# EAGLE schematic item_2022_Frontend_01 (EAGLE 9.6.2)
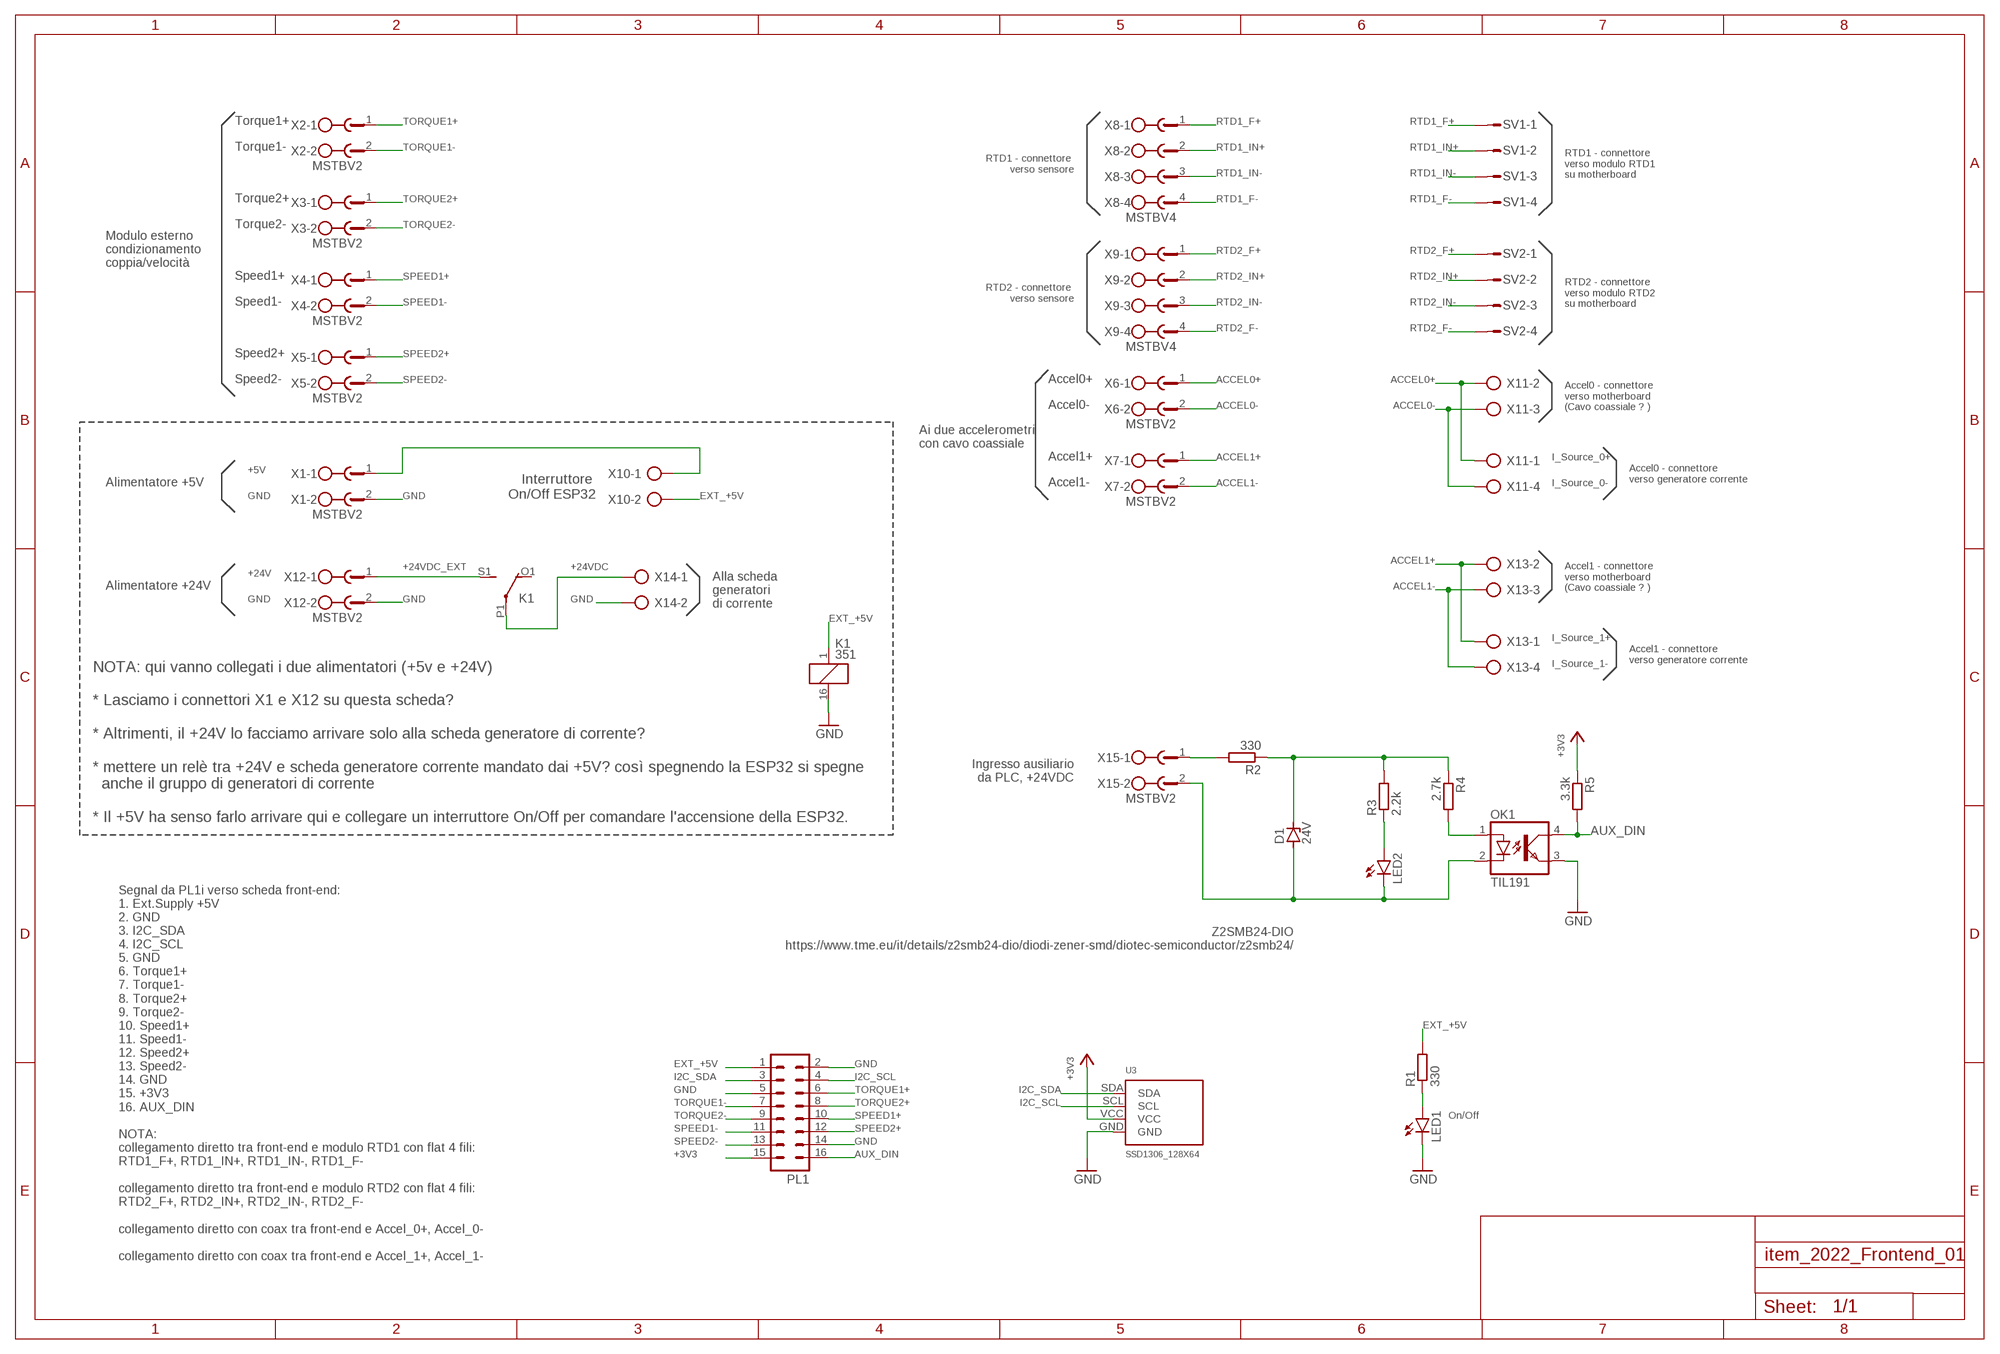
[diagram p0: schematic, sheet 1]

## Parts
D1  24V  ZENER-DIODESMB  [SMB]
K1  351  [351]
LED1  LED5MM  [LED5MM]
LED2  LED5MM  [LED5MM]
OK1  TIL191  [DIL04]
PL1  16V  [16V]
R1  330  R-EU_R0805  [R0805]
R2  330  R-EU_R0805  [R0805]
R3  2.2k  R-EU_R0805  [R0805]
R4  2.7k  R-EU_R0805  [R0805]
R5  3.3k  R-EU_R0805  [R0805]
SV1  S04P  [S04P]
SV2  S04P  [S04P]
U3  SSD1306_128X64  [128X64]
X1  MSTBV2  [MSTBV2]
X2  MSTBV2  [MSTBV2]
X3  MSTBV2  [MSTBV2]
X4  MSTBV2  [MSTBV2]
X5  MSTBV2  [MSTBV2]
X6  MSTBV2  [MSTBV2]
X7  MSTBV2  [MSTBV2]
X8  MSTBV4  [MSTBV4]
X9  MSTBV4  [MSTBV4]
X10  AK500/2  [AK500/2]
X11  AK500/4  [AK500/4]
X12  MSTBV2  [MSTBV2]
X13  AK500/4  [AK500/4]
X14  AK500/2  [AK500/2]
X15  MSTBV2  [MSTBV2]

## Nets
+3V3: PL1.15 R5.1 U3.VCC
+24VDC: K1.P1(2:P) X14.1
+24VDC_EXT: K1.S1(2:S) X12.1
ACCEL0+: X6.1 X11.1 X11.2
ACCEL0-: X6.2 X11.3 X11.4
ACCEL1+: X7.1 X13.1 X13.2
ACCEL1-: X7.2 X13.3 X13.4
AUX_DIN: OK1.4(COL) PL1.16 R5.2
EXT_+5V: K1.1 PL1.1 R1.2 X10.2
GND: K1.16 LED1.K(C) OK1.3(EMIT) PL1.2 PL1.5 PL1.14 U3.GND X1.2 X12.2 X14.2
I2C_SCL: PL1.4 U3.SCL
I2C_SDA: PL1.3 U3.SDA
N$1: R2.2 X15.1
N$2: X1.1 X10.1
N$3: LED1.A R1.1
N$4: D1.C R2.1 R3.2 R4.1
N$5: D1.A LED2.K(C) OK1.2(C) X15.2
N$8: LED2.A R3.1
N$9: OK1.1(A) R4.2
RTD1_F+: SV1.1 X8.1
RTD1_F-: SV1.4 X8.4
RTD1_IN+: SV1.2 X8.2
RTD1_IN-: SV1.3 X8.3
RTD2_F+: SV2.1 X9.1
RTD2_F-: SV2.4 X9.4
RTD2_IN+: SV2.2 X9.2
RTD2_IN-: SV2.3 X9.3
SPEED1+: PL1.10 X4.1
SPEED1-: PL1.11 X4.2
SPEED2+: PL1.12 X5.1
SPEED2-: PL1.13 X5.2
TORQUE1+: PL1.6 X2.1
TORQUE1-: PL1.7 X2.2
TORQUE2+: PL1.8 X3.1
TORQUE2-: PL1.9 X3.2
Unconnected: K1.O1(2:O) K1.O2(3:O) K1.P2(3:P) K1.S2(3:S)

## Notes on the sheet
- Torque1+
- Torque1-
- RTD1 - connettore 
  verso sensore
- RTD1 - connettore 
  verso modulo RTD1
  su motherboard
- Torque2+
- Torque2-
- Modulo esterno
  condizionamento
  coppia/velocità
- Speed1+
- RTD2 - connettore 
  verso sensore
- RTD2 - connettore 
  verso modulo RTD2
  su motherboard
- Speed1-
- Speed2+
- Speed2- | Accel0+
- Accel0 - connettore 
  verso motherboard
  (Cavo coassiale ? )
- Accel0-
- Ai due accelerometri
  con cavo coassiale
- Accel1+ | I_Source_0+
- +5V
- Accel0 - connettore 
  verso generatore corrente
- Alimentatore +5V
- Interruttore 
  On/Off ESP32
- Accel1- | I_Source_0-
- GND
- +24V
- Accel1 - connettore 
  verso motherboard
  (Cavo coassiale ? )
- Alimentatore +24V
- Alla scheda 
  generatori
  di corrente
- GND
- I_Source_1+
- Accel1 - connettore 
  verso generatore corrente
- I_Source_1-
- Ingresso ausiliario
  da PLC, +24VDC
- NOTA: qui vanno collegati i due alimentatori (+5v e +24V)
  
  * Lasciamo i connettori X1 e X12 su questa scheda?
  
  * Altrimenti, il +24V lo facciamo arrivare solo alla scheda generatore di corrente?
  
  * mettere un relè tra +24V e scheda generatore corrente mandato dai +5V? così spegnendo la ESP32 si spegne
    anche il gruppo di generatori di corrente
  
  * Il +5V ha senso farlo arrivare qui e collegare un interruttore On/Off per comandare l'accensione della ESP32.
- Z2SMB24-DIO
  https://www.tme.eu/it/details/z2smb24-dio/diodi-zener-smd/diotec-semiconductor/z2smb24/
- On/Off
- Segnal da PL1i verso scheda front-end:
  1. Ext.Supply +5V
  2. GND
  3. I2C_SDA
  4. I2C_SCL
  5. GND
  6. Torque1+
  7. Torque1-
  8. Torque2+
  9. Torque2-
  10. Speed1+
  11. Speed1-
  12. Speed2+
  13. Speed2-
  14. GND
  15. +3V3
  16. AUX_DIN
  
  NOTA:
  collegamento diretto tra front-end e modulo RTD1 con flat 4 fili:
  RTD1_F+, RTD1_IN+, RTD1_IN-, RTD1_F-
  
  collegamento diretto tra front-end e modulo RTD2 con flat 4 fili:
  RTD2_F+, RTD2_IN+, RTD2_IN-, RTD2_F-
  
  collegamento diretto con coax tra front-end e Accel_0+, Accel_0-
  
  collegamento diretto con coax tra front-end e Accel_1+, Accel_1-

## Library data of the parts
D1 = diode:ZENER-DIODE: Z-Diode
K1 = relay:351: RELAY 2 x switch, Omron; OC_FARNELL: unknown; OC_NEWARK: unknown
LED1 LED2 = led:LED: LED OSRAM: - CHIPLED LG R971, LG N971, LY N971, LG Q971, LY Q971, LO R971, LY R971 LH N974, LH R974 LS Q976, LO Q976, LY Q976 LO Q996 - Hyper CHIPLED LW Q18S LB Q993, LB Q99A, LB R99A - SideLED LS A670, LO A670, LY A670, LG A670, LP A670 LB A673, LV A673, LT A673, LW A673 LH A674 LY A675 LS A676, LA A676, LO A676, LY A676, LW A676 LS A679, LY A679, LG A679 - Hyper Micro SIDELED® LS Y876, LA Y876, LO Y876, LY Y876 LT Y87S - SmartLED LW L88C, LW L88S LB L89C, LB L89S, LG L890 LS L89K, LO L89K, LY L89K LS L896, LA L896, LO L896, LY L896 - TOPLED LS T670, LO T670, LY T670, LG T670, LP T670 LSG T670, LSP T670, LSY T670, LOP T670, LYG T670 LG T671, LOG T671, LSG T671 LB T673, LV T673, LT T673, LW T673 LH T674 LS T676, LA T676, LO T676, LY T676, LB T676, LH T676, LSB T676, LW T676 LB T67C, LV T67C, LT T67C, LS T67K, LO T67K, LY T67K, LW E67C LS E67B, LA E67B, LO E67B, LY E67B, LB E67C, LV E67C, LT E67C LW T67C LS T679, LY T679, LG T679 LS T770, LO T770, LY T770, LG T770, LP T770 LB T773, LV T773, LT T773, LW T773 LH T774 LS E675, LA E675, LY E675, LS T675 LS T776, LA T776, LO T776, LY T776, LB T776 LHGB T686 LT T68C, LB T68C - Hyper Mini TOPLED® LB M676 - Mini TOPLED Santana® LG M470 LS M47K, LO M47K, LY M47K Source: http://www.osram.convergy.de LUXEON: - LUMILED® LXK2-PW12-R00, LXK2-PW12-S00, LXK2-PW14-U00, LXK2-PW14-V00 LXK2-PM12-R00, LXK2-PM12-S00, LXK2-PM14-U00 LXK2-PE12-Q00, LXK2-PE12-R00, LXK2-PE12-S00, LXK2-PE14-T00, LXK2-PE14-U00 LXK2-PB12-K00, LXK2-PB12-L00, LXK2-PB12-M00, LXK2-PB14-N00, LXK2-PB14-P00, LXK2-PB14-Q00 LXK2-PR12-L00, LXK2-PR12-M00, LXK2-PR14-Q00, LXK2-PR14-R00 LXK2-PD12-Q00, LXK2-PD12-R00, LXK2-PD12-S00 LXK2-PH12-R00, LXK2-PH12-S00 LXK2-PL12-P00, LXK2-PL12-Q00, LXK2-PL12-R00 Source: www.luxeon.com KINGBRIGHT: KA-3528ASYC Source: www.kingbright.com
OK1 = optocoupler:TIL191: TEXAS INSTRUMENTS OPTO COUPLER; OC_FARNELL: 1683363; OC_NEWARK: unknown
PL1 = con-harting-v:16V: CONNECTOR; OC_FARNELL: unknown; OC_NEWARK: unknown
R1-R5 = rcl:R-EU_: RESISTOR, European symbol; SPICEPREFIX: R
SV1 SV2 = con-amp-mt:S04P: AMP MT CONNECTOR; OC_FARNELL: unknown; OC_NEWARK: unknown
U3 = ssd1306oled:SSD1306_128X64: OLED Display Board 0.91" 128x64 White I2C - 4 Pins - SSD1306
X1-X7 X12 X15 = con-phoenix-508:MSTBV2: PHOENIX; MPN: MSTBV 2,5/2-GF-5.08; OC_FARNELL: 1792792; OC_NEWARK: 69R9845
X8 X9 = con-phoenix-508:MSTBV4: PHOENIX; MPN: MSTBV 2,5/4-GF-5.08; OC_FARNELL: 1792794; OC_NEWARK: 69R9847
X10 X14 = con-ptr500:AK500/2: CONNECTOR; OC_FARNELL: unknown; OC_NEWARK: unknown
X11 X13 = con-ptr500:AK500/4: CONNECTOR; OC_FARNELL: unknown; OC_NEWARK: unknown